# EAGLE design flip flop 4LED (EAGLE 6.5.0)
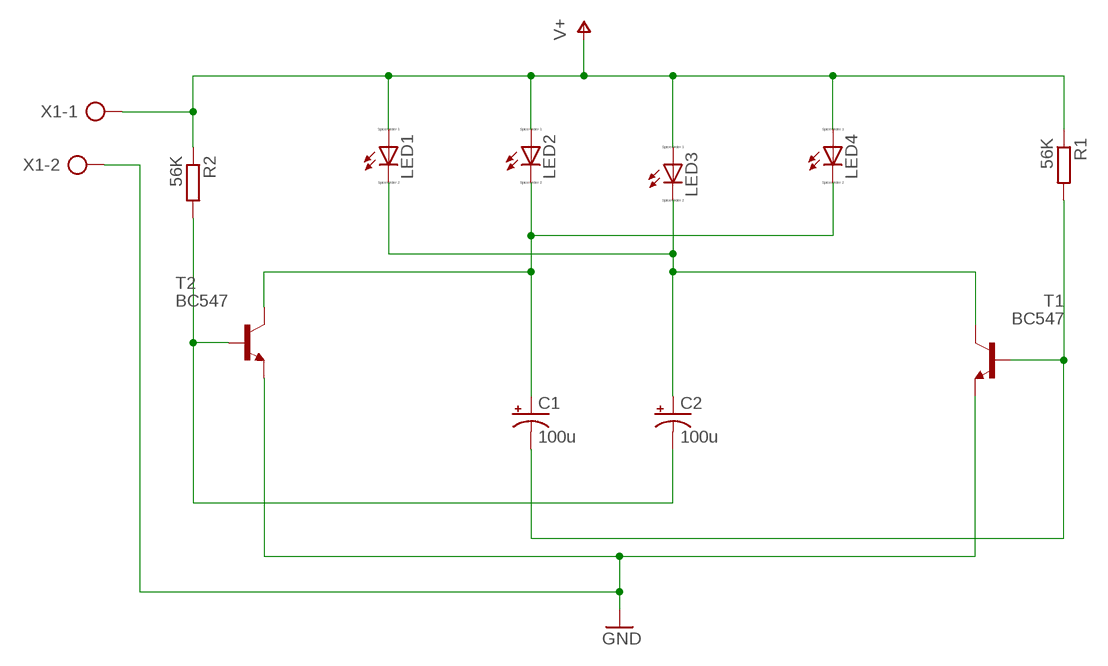
[diagram p0: schematic, sheet 1]

## Parts
C1  100u  CPOL-USE5-5  [E5-5]
C2  100u  CPOL-USE5-5  [E5-5]
LED1  LED_ELD260  [LED_LD260]
LED2  LED_ELD260  [LED_LD260]
LED3  LED_ELD260  [LED_LD260]
LED4  LED_ELD260  [LED_LD260]
R1  56K  R-EU_0309/12  [0309/12]
R2  56K  R-EU_0309/12  [0309/12]
T1  BC547  [TO92]
T2  BC547  [TO92]
X1  AK500/2-H  [AK500/2-H]

## Nets
GND: T1.1(E) T2.1(E) X1.2
N$2: C2.+ LED1.K(C) LED3.K(C) T1.3(C)
N$3: C1.- R1.2 T1.2(B)
N$4: C1.+ LED2.K(C) LED4.K(C) T2.3(C)
N$5: C2.- R2.2 T2.2(B)
V+: LED1.A LED2.A LED3.A LED4.A R1.1 R2.1 X1.1

## Library data of the parts
C1 C2 = rcl:CPOL-US: POLARIZED CAPACITOR, American symbol
LED1-LED4 = eagle-ltspice:LED_E: LED Source: http://www.osram.convergy.de Source: www.luxeon.com Source: www.kingbright.com; SPICEMODEL: NONE; SPICEPREFIX: D; SPICETYPE: diode
R1 R2 = rcl:R-EU_: RESISTOR, European symbol
T1 T2 = transistor:BC547: NPN TRANSISTOR
X1 = con-ptr500:AK500/2-H: CONNECTOR Aug. 2004 / PTR Meßtechnik: Die Bezeichnung der Serie AK505 wurde geändert. Es handelt sich hierbei um AK500 in horizontaler Ausführung.; OC_FARNELL: unknown; OC_NEWARK: unknown

## Board
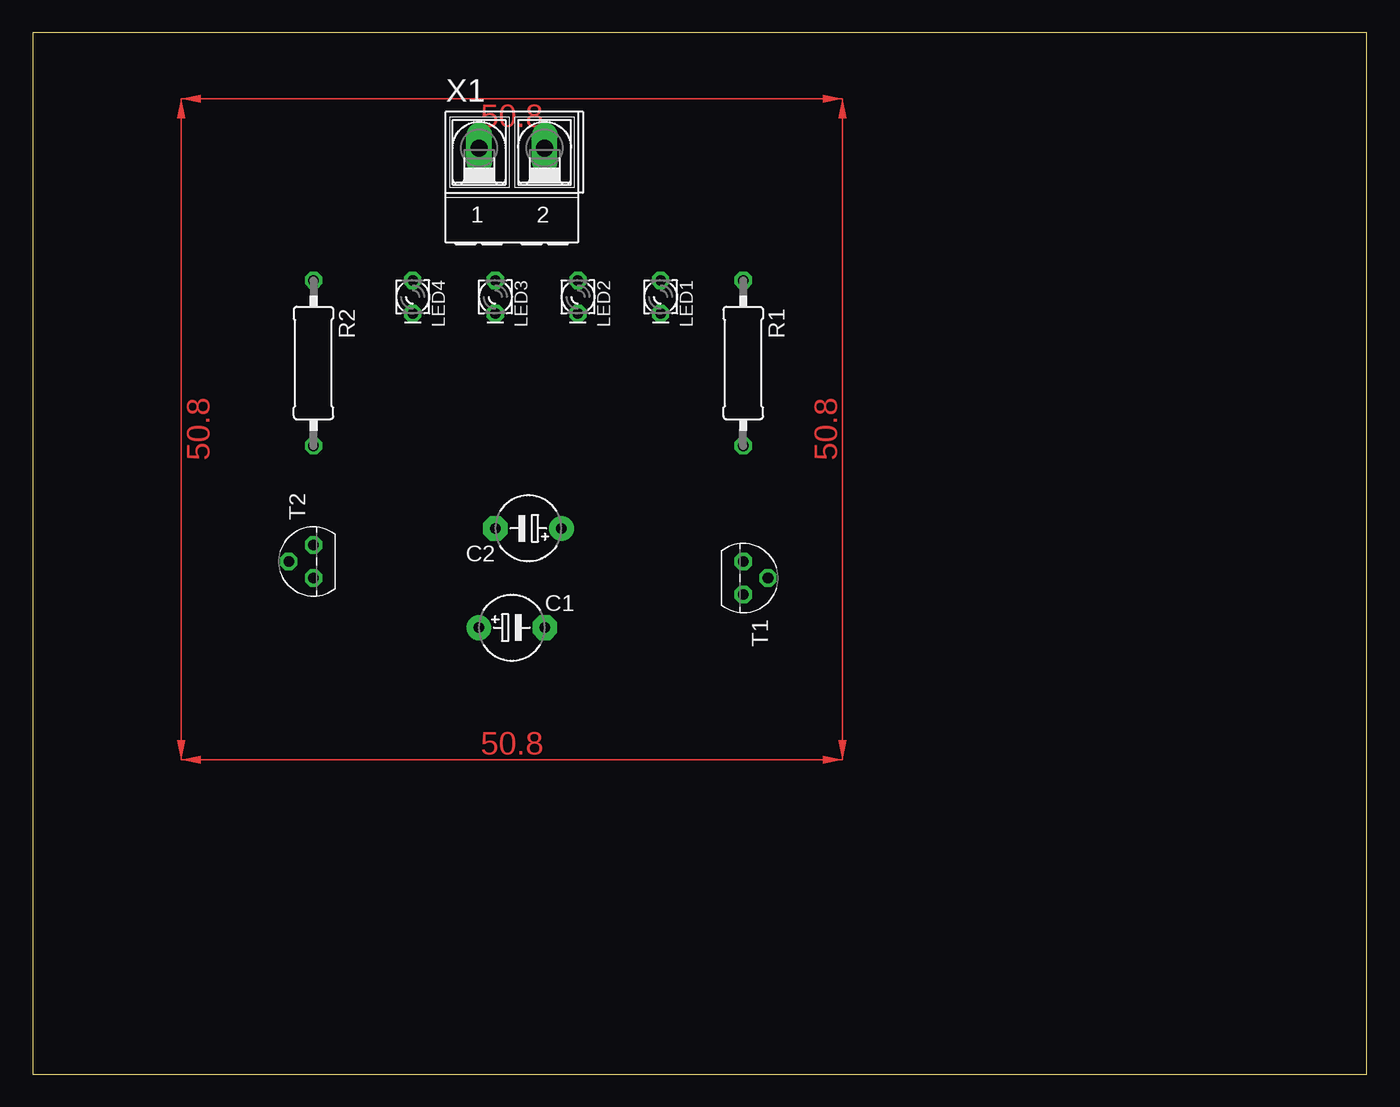
[diagram p1: board, top side]
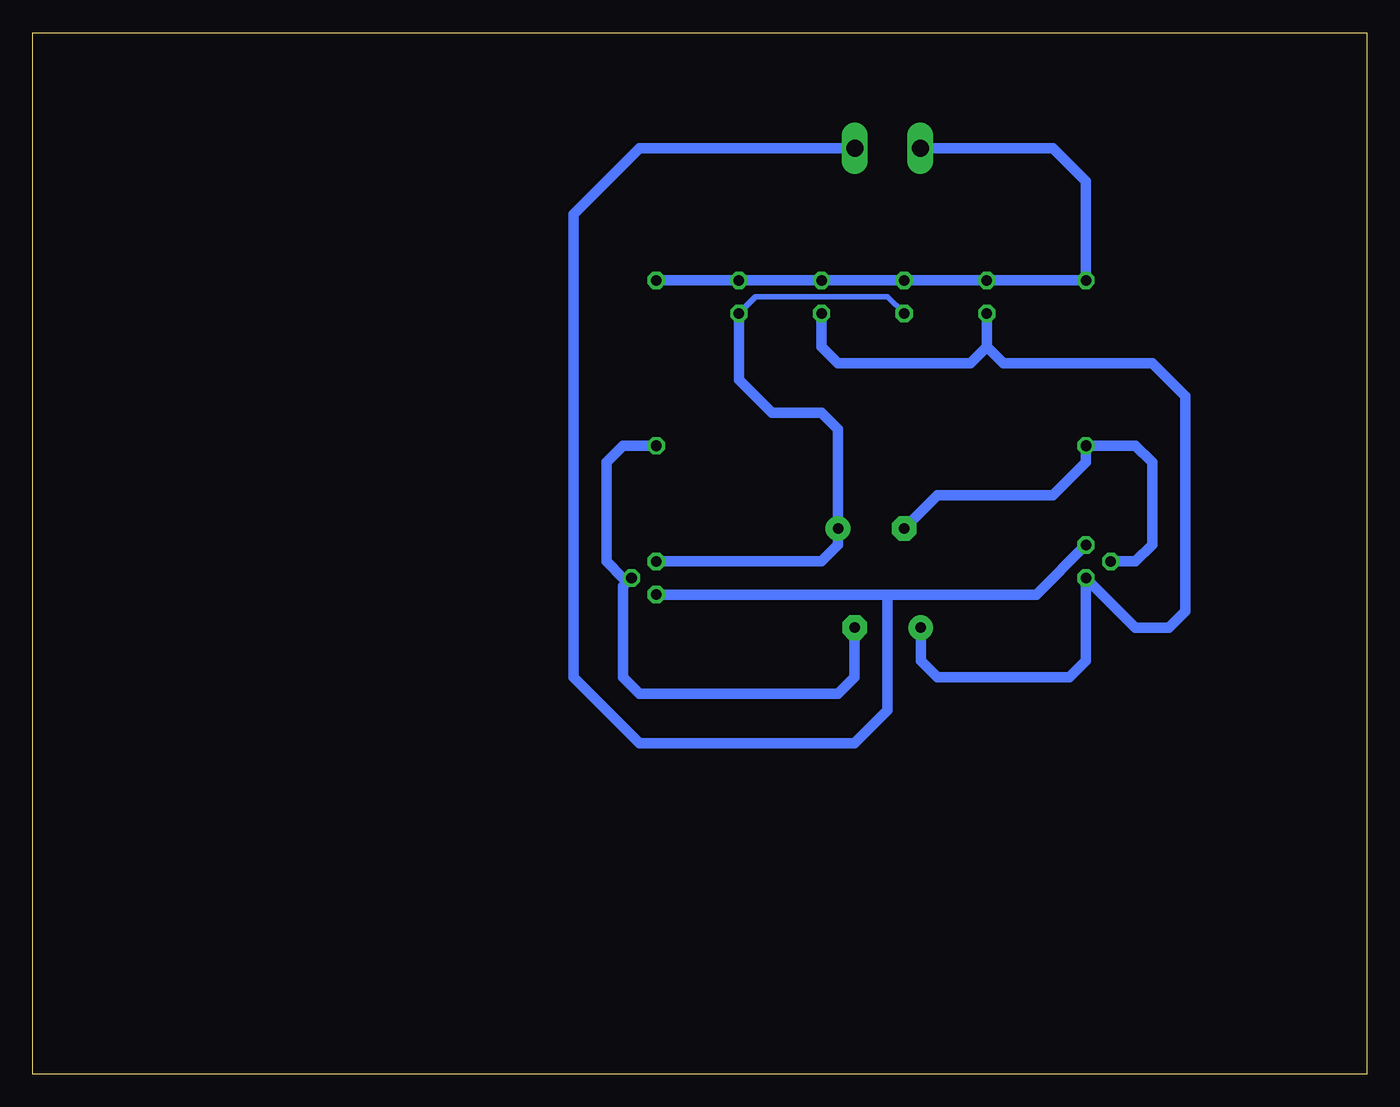
[diagram p2: board, bottom side, seen from below]

Size 102.54 x 80 mm. Coordinates in mm from the lower left corner, seen from the top.
Outline: 0,0 102.54,0 102.54,80 0,80 0,0
Copper layers (1*16): Top 0.035mm / dielectric 1.5mm / Bottom 0.035mm
Design rules "default": minimum track width 10mil, minimum drill 24mil, track to track 8mil, track to pad 8mil, pad to pad 8mil, via to via 8mil, smd to smd 8mil, copper to edge 40mil, drill to drill 8mil, minimum pad ring 10mil, minimum via ring 8mil, stop-mask expansion 4mil, vias tented up to drill 0mil, thermal gap 10mil

### Footprints (pad centres in the part's own frame; a part is rotated, then mirrored left to right if it is on the bottom)
E5-5 = drill 0.813 pad 1.905: + -2.54,0 | drill 0.813 pad 1.905 octagon: - 2.54,0
LED_LD260 = drill 0.813 octagon: A -1.27,0; K 1.27,0
0309/12 = drill 0.813 octagon: 1 -6.35,0; 2 6.35,0
TO92 = drill 0.813 octagon: 1 1.27,0; 2 0,1.905; 3 -1.27,0
AK500/2-H = drill 1.321 long: 1 -2.515,0; 2 2.515,0

### Placement (x,y rotation side)
C1  36.83,34.29 0 top
C2  38.1,41.91 180 top
LED1  48.26,59.69 270 top
LED2  41.91,59.69 270 top
LED3  35.56,59.69 270 top
LED4  29.21,59.69 270 top
R1  54.61,54.61 270 top
R2  21.59,54.61 270 top
T1  54.61,38.1 270 top
T2  21.59,39.37 90 top
X1  36.83,71.12 0 top

### Tracks (layer width: path | path; a pad name or v marks a point on that pad's centre or on a via)
GND
  Bottom 0.813: T1.1 36.83,36.83 | 36.83,36.83 25.4,36.83 T2.1 | X1.2 55.88,71.12 60.96,66.04 60.96,30.48 55.88,25.4 39.37,25.4 36.83,27.94 36.83,36.83
N$2
  Bottom 0.406: LED3.K 36.83,59.69 46.99,59.69 LED1.K
  Bottom 0.813: T1.3 41.91,39.37 40.64,40.64 C2.+ 40.64,49.53 41.91,50.8 45.72,50.8 48.26,53.34 LED1.K
N$3
  Bottom 0.813: R1.2 57.15,48.26 58.42,46.99 58.42,39.37 57.15,38.1 T1.2 57.15,37.47 57.15,30.48 55.88,29.21 40.64,29.21 39.37,30.48 C1.-
N$4
  Bottom 0.813: LED4.K 29.21,55.88 | 29.21,55.88 30.48,54.61 40.64,54.61 41.91,55.88 LED2.K | C1.+ 34.29,31.75 33.02,30.48 22.86,30.48 21.59,31.75 T2.3 17.78,34.29 15.24,34.29 13.97,35.56 13.97,52.07 16.51,54.61 27.94,54.61 29.21,55.88
N$5
  Bottom 0.813: T2.2 17.78,39.37 16.51,40.64 16.51,46.99 17.78,48.26 R2.2 21.59,46.99 24.13,44.45 33.02,44.45 C2.-
V+
  Bottom 0.813: X1.1 24.13,71.12 21.59,68.58 R2.1 LED4.A LED3.A LED2.A LED1.A R1.1
(copper drawn outside any net)
  shapes: Top area x4